# EAGLE schematic Schematic v17 (EAGLE 9.7.0)
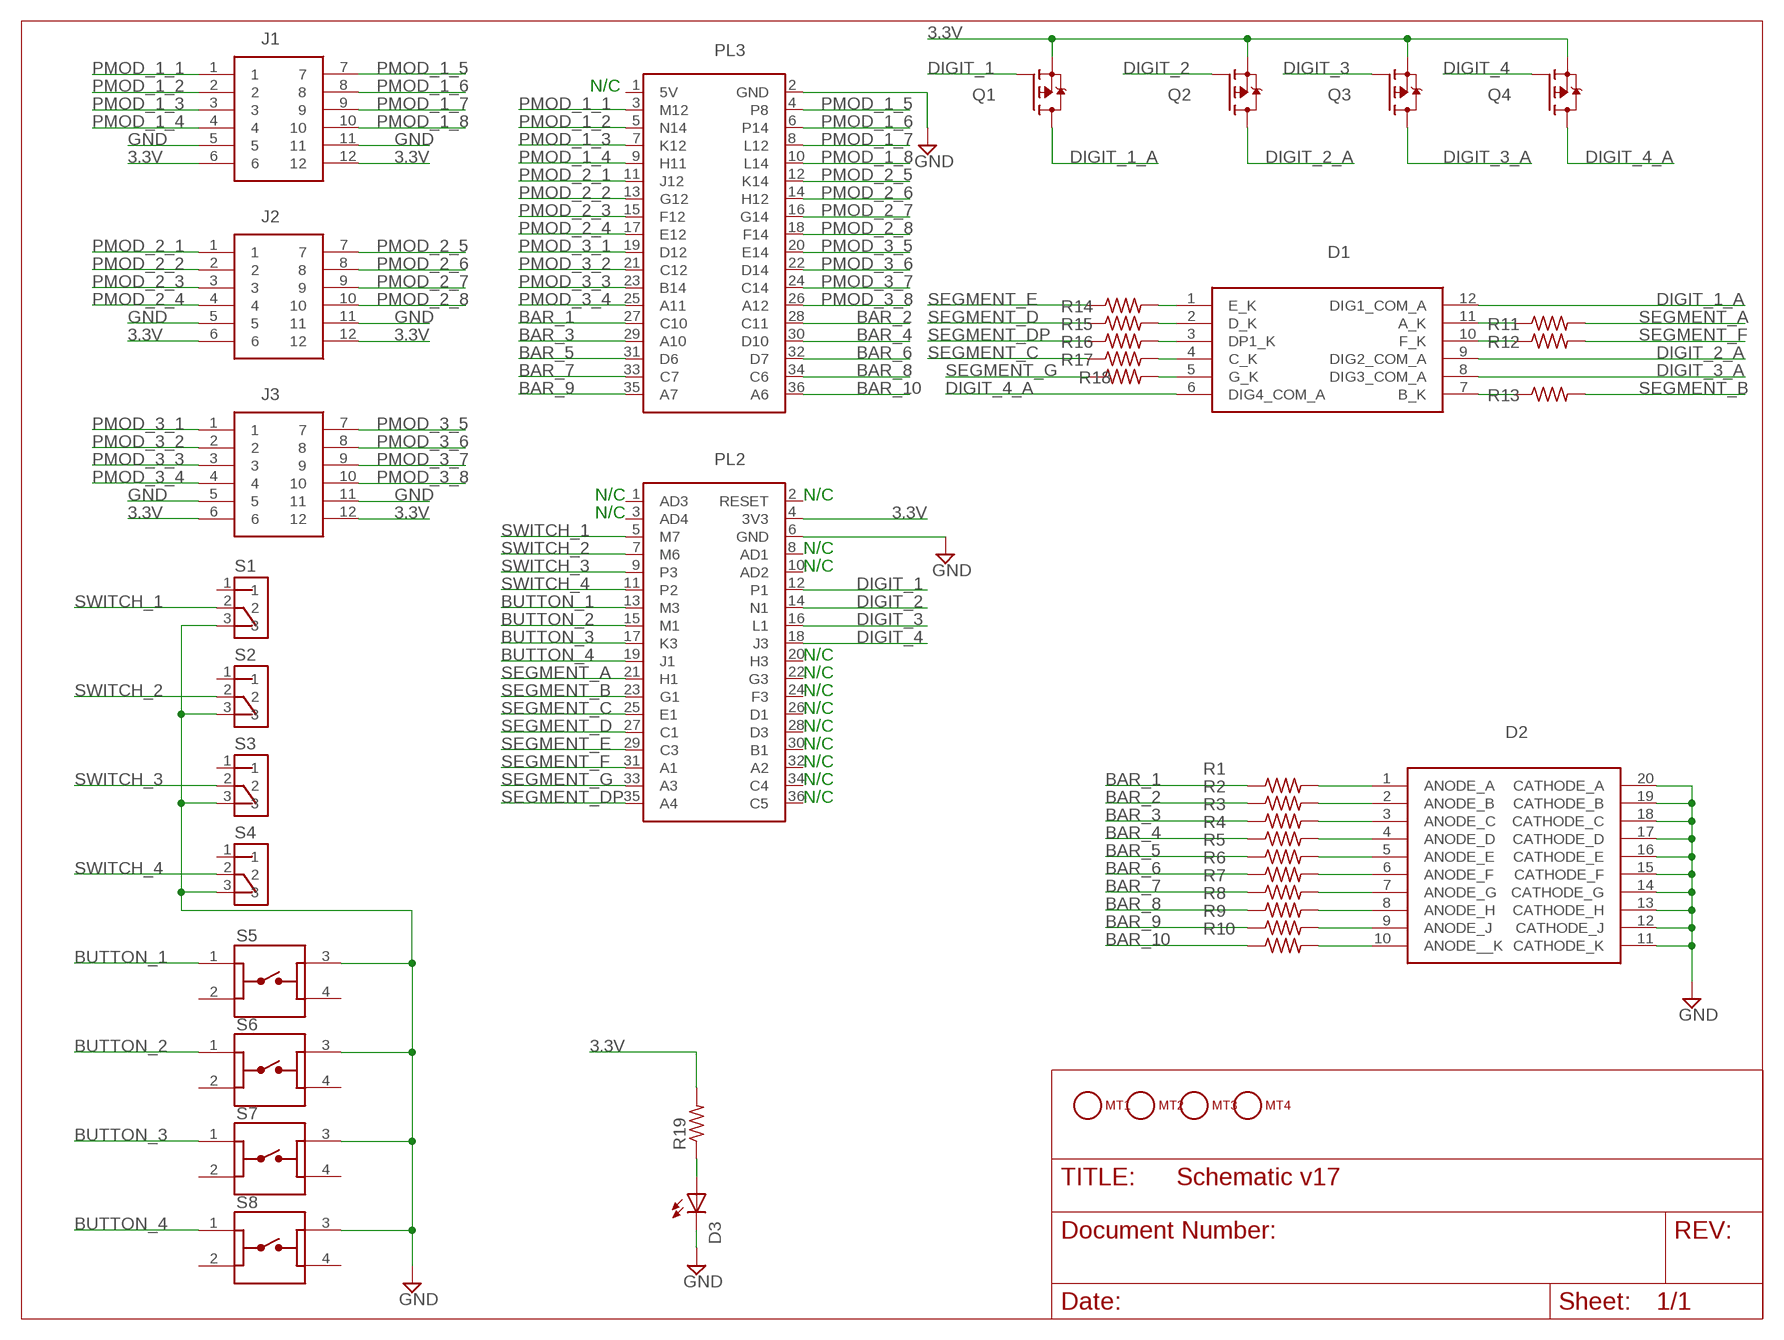
[diagram p0: schematic, sheet 1]

## Parts
D1  LDQ-M282RI  [LDQM282RI]
D2  LTA-1000G  [DIPS762W50P254L2527H825Q20N]
D3  LED5MM  [LED5MM]
J1  PMOD-SOCKET-FOR-HOST-BOARD  [PMOD-SOCKET-FOR-HOST-BOARD]
J2  PMOD-SOCKET-FOR-HOST-BOARD  [PMOD-SOCKET-FOR-HOST-BOARD]
J3  PMOD-SOCKET-FOR-HOST-BOARD  [PMOD-SOCKET-FOR-HOST-BOARD]
MT1  MOUNTING_HOLE-125_250_ROUND  [MT_125_250]
MT2  MOUNTING_HOLE-125_250_ROUND  [MT_125_250]
MT3  MOUNTING_HOLE-125_250_ROUND  [MT_125_250]
MT4  MOUNTING_HOLE-125_250_ROUND  [MT_125_250]
PL2  ICEWERX-PL2  [TE_4-1734506-1]
PL3  ICEWERX-PL3  [TE_4-1734506-1]
Q1  NX2301P  [SOT95P230X110-3N]
Q2  NX2301P  [SOT95P230X110-3N]
Q3  NX2301P  [SOT95P230X110-3N]
Q4  NX2301P  [SOT95P230X110-3N]
R1  R-US_0204/5  [0204/5]
R2  R-US_0204/5  [0204/5]
R3  R-US_0204/5  [0204/5]
R4  R-US_0204/5  [0204/5]
R5  R-US_0204/5  [0204/5]
R6  R-US_0204/5  [0204/5]
R7  R-US_0204/5  [0204/5]
R8  R-US_0204/5  [0204/5]
R9  R-US_0204/5  [0204/5]
R10  R-US_0204/5  [0204/5]
R11  R-US_0204/5  [0204/5]
R12  R-US_0204/5  [0204/5]
R13  R-US_0204/5  [0204/5]
R14  R-US_0204/5  [0204/5]
R15  R-US_0204/5  [0204/5]
R16  R-US_0204/5  [0204/5]
R17  R-US_0204/5  [0204/5]
R18  R-US_0204/5  [0204/5]
R19  R-US_0204/5  [0204/5]
S1  OS102011MS2QN1  [SW_OS102011MS2QN1]
S2  OS102011MS2QN1  [SW_OS102011MS2QN1]
S3  OS102011MS2QN1  [SW_OS102011MS2QN1]
S4  OS102011MS2QN1  [SW_OS102011MS2QN1]
S5  1825910-7  [SW_1825910-7]
S6  1825910-7  [SW_1825910-7]
S7  1825910-7  [SW_1825910-7]
S8  1825910-7  [SW_1825910-7]

## Nets
3.3V: J1.6 J1.12 J2.6 J2.12 J3.6 J3.12 PL2.4(3V3) Q1.2(S) Q2.2(S) Q3.2(S) Q4.2(S) R19.2
BAR_1: PL3.27(C10) R1.1
BAR_2: PL3.28(C11) R2.1
BAR_3: PL3.29(A10) R3.1
BAR_4: PL3.30(D10) R4.1
BAR_5: PL3.31(D6) R5.1
BAR_6: PL3.32(D7) R6.1
BAR_7: PL3.33(C7) R7.1
BAR_8: PL3.34(C6) R8.1
BAR_9: PL3.35(A7) R9.1
BAR_10: PL3.36(A6) R10.1
BUTTON_1: PL2.13(M3) S5.1
BUTTON_2: PL2.15(M1) S6.1
BUTTON_3: PL2.17(K3) S7.1
BUTTON_4: PL2.19(J1) S8.1
DIGIT_1: PL2.12(P1) Q1.1(G)
DIGIT_1_A: D1.12(DIG1_COM_A) Q1.3(D)
DIGIT_2: PL2.14(N1) Q2.1(G)
DIGIT_2_A: D1.9(DIG2_COM_A) Q2.3(D)
DIGIT_3: PL2.16(L1) Q3.1(G)
DIGIT_3_A: D1.8(DIG3_COM_A) Q3.3(D)
DIGIT_4: PL2.18(J3) Q4.1(G)
DIGIT_4_A: D1.6(DIG4_COM_A) Q4.3(D)
GND: D2.11(CATHODE_K) D2.12(CATHODE_J) D2.13(CATHODE_H) D2.14(CATHODE_G) D2.15(CATHODE_F) D2.16(CATHODE_E) D2.17(CATHODE_D) D2.18(CATHODE_C) D2.19(CATHODE_B) D2.20(CATHODE_A) D3.K(C) J1.5 J1.11 J2.5 J2.11 J3.5 J3.11 PL2.6(GND) PL3.2(GND) S1.3 S2.3 S3.3 S4.3 S5.3 S6.3 S7.3 S8.3
N$1: D2.1(ANODE_A) R1.2
N$2: D2.2(ANODE_B) R2.2
N$3: D2.3(ANODE_C) R3.2
N$4: D2.4(ANODE_D) R4.2
N$5: D2.5(ANODE_E) R5.2
N$6: D2.6(ANODE_F) R6.2
N$7: D2.7(ANODE_G) R7.2
N$8: D2.8(ANODE_H) R8.2
N$9: D2.9(ANODE_J) R9.2
N$10: D2.10(ANODE__K) R10.2
N$11: D1.11(A_K) R11.1
N$12: D1.10(F_K) R12.1
N$13: D1.2(D_K) R15.2
N$14: D1.7(B_K) R13.1
N$15: D1.3(DP1_K) R16.2
N$16: D1.1(E_K) R14.2
N$17: D1.4(C_K) R17.2
N$18: D1.5(G_K) R18.2
N$20: D3.A R19.1
PMOD_1_1: J1.1 PL3.3(M12)
PMOD_1_2: J1.2 PL3.5(N14)
PMOD_1_3: J1.3 PL3.7(K12)
PMOD_1_4: J1.4 PL3.9(H11)
PMOD_1_5: J1.7 PL3.4(P8)
PMOD_1_6: J1.8 PL3.6(P14)
PMOD_1_7: J1.9 PL3.8(L12)
PMOD_1_8: J1.10 PL3.10(L14)
PMOD_2_1: J2.1 PL3.11(J12)
PMOD_2_2: J2.2 PL3.13(G12)
PMOD_2_3: J2.3 PL3.15(F12)
PMOD_2_4: J2.4 PL3.17(E12)
PMOD_2_5: J2.7 PL3.12(K14)
PMOD_2_6: J2.8 PL3.14(H12)
PMOD_2_7: J2.9 PL3.16(G14)
PMOD_2_8: J2.10 PL3.18(F14)
PMOD_3_1: J3.1 PL3.19(D12)
PMOD_3_2: J3.2 PL3.21(C12)
PMOD_3_3: J3.3 PL3.23(B14)
PMOD_3_4: J3.4 PL3.25(A11)
PMOD_3_5: J3.7 PL3.20(E14)
PMOD_3_6: J3.8 PL3.22(D14)
PMOD_3_7: J3.9 PL3.24(C14)
PMOD_3_8: J3.10 PL3.26(A12)
SEGMENT_A: PL2.21(H1) R11.2
SEGMENT_B: PL2.23(G1) R13.2
SEGMENT_C: PL2.25(E1) R17.1
SEGMENT_D: PL2.27(C1) R15.1
SEGMENT_DP: PL2.35(A4) R16.1
SEGMENT_E: PL2.29(C3) R14.1
SEGMENT_F: PL2.31(A1) R12.2
SEGMENT_G: PL2.33(A3) R18.1
SWITCH_1: PL2.5(M7) S1.2
SWITCH_2: PL2.7(M6) S2.2
SWITCH_3: PL2.9(P3) S3.2
SWITCH_4: PL2.11(P2) S4.2
Unconnected: MT1.1 MT2.1 MT3.1 MT4.1 PL2.1(AD3) PL2.2(RESET) PL2.3(AD4) PL2.8(AD1) PL2.10(AD2) PL2.20(H3) PL2.22(G3) PL2.24(F3) PL2.26(D1) PL2.28(D3) PL2.30(B1) PL2.32(A2) PL2.34(C4) PL2.36(C5) PL3.1(5V) S1.1 S2.1 S3.1 S4.1 S5.2 S5.4 S6.2 S6.4 S7.2 S7.4 S8.2 S8.4

## Notes on the sheet
- N/C
- N/C | N/C
- N/C
- N/C
- N/C
- N/C
- N/C
- N/C
- N/C
- N/C
- N/C
- N/C
- N/C
- N/C

## Library data of the parts
D1 = eagle-library-engr-240-f24:LDQ-M282RI: LED Displays & Accessories LED Display Source: Datasheet <https://componentsearchengine.com/Datasheets/1/LDQ-M282RI.pdf>; DESCRIPTION: LED Displays & Accessories LED Display; HEIGHT: 6.05mm; MANUFACTURER_NAME: Lumex; MANUFACTURER_PART_NUMBER: LDQ-M282RI; MOUSER_PART_NUMBER: 696-LDQ-M282RI; MOUSER_PRICE-STOCK: https://www.mouser.com/Search/Refine.aspx?Keyword=696-LDQ-M282RI
D2 = eagle-library-engr-240-f24:LTA-1000G: LED Uni-Color Green 565nm 20-Pin PDIP Source: Datasheet <https://optoelectronics.liteon.com/upload/download/DS-30-92-0809/A1000G.pdf>; DESCRIPTION: LED Uni-Color Green 565nm 20-Pin PDIP; HEIGHT: 8.25mm; MANUFACTURER_NAME: Lite-On; MANUFACTURER_PART_NUMBER: LTA-1000G; MOUSER_PART_NUMBER: 859-LTA-1000G; MOUSER_PRICE-STOCK: https://www.mouser.co.uk/ProductDetail/Lite-On/LTA-1000G?qs=%2FTKcI5XXRKq0QINzVmwJHg%3D%3D
D3 = eagle-library-engr-240-f24:LED: LED OSRAM: - CHIPLED LG R971, LG N971, LY N971, LG Q971, LY Q971, LO R971, LY R971 LH N974, LH R974 LS Q976, LO Q976, LY Q976 LO Q996 - Hyper CHIPLED LW Q18S LB Q993, LB Q99A, LB R99A - SideLED LS A670, LO A670, LY A670, LG A670, LP A670 LB A673, LV A673, LT A673, LW A673 LH A674 LY A675 LS A676, LA A676, LO A676, LY A676, LW A676 LS A679, LY A679, LG A679 - Hyper Micro SIDELED® LS Y876, LA Y876, LO Y876, LY Y876 LT Y87S - SmartLED LW L88C, LW L88S LB L89C, LB L89S, LG L890 LS L89K, LO L89K, LY L89K LS L896, LA L896, LO L896, LY L896 - TOPLED LS T670, LO T670, LY T670, LG T670, LP T670 LSG T670, LSP T670, LSY T670, LOP T670, LYG T670 LG T671, LOG T671, LSG T671 LB T673, LV T673, LT T673, LW T673 LH T674 LS T676, LA T676, LO T676, LY T676, LB T676, LH T676, LSB T676, LW T676 LB T67C, LV T67C, LT T67C, LS T67K, LO T67K, LY T67K, LW E67C LS E67B, LA E67B, LO E67B, LY E67B, LB E67C, LV E67C, LT E67C LW T67C LS T679, LY T679, LG T679 LS T770, LO T770, LY T770, LG T770, LP T770 LB T773, LV T773, LT T773, LW T773 LH T774 LS E675, LA E675, LY E675, LS T675 LS T776, LA T776, LO T776, LY T776, LB T776 LHGB T686 LT T68C, LB T68C - Hyper Mini TOPLED® LB M676 - Mini TOPLED Santana® LG M470 LS M47K, LO M47K, LY M47K Source: http://www.osram.convergy.de/
J1-J3 = eagle-library-engr-240-f24:PMOD-SOCKET-FOR-HOST-BOARD
MT1-MT4 = eagle-library-engr-240-f24:MOUNTING_HOLE
PL2 = eagle-library-engr-240-f24:ICEWERX-PL2
PL3 = eagle-library-engr-240-f24:ICEWERX-PL3
Q1-Q4 = eagle-library-engr-240-f24:NX2301P; MANUFACTURER: Nexperia; MAXIMUM_PACKAGE_HEIGHT: 1.10 mm; PARTREV: 1; SNAPEDA_PN: NX2301P; STANDARD: IPC 7351B
R1-R19 = eagle-library-engr-240-f24:R-US_: RESISTOR, American symbol
S1-S4 = eagle-library-engr-240-f24:OS102011MS2QN1: Switch Slide ON ON SPDT Top Slide 0.1A 12VDC 10000Cycles PC Pins Thru-Hole Bulk; MANUFACTURER: C&K; STANDARD: MANUFACTURER RECOMMENDATIONS
S5-S8 = eagle-library-engr-240-f24:1825910-7: Switch Tactile OFF (ON) SPST Round Button PC Pins 0.05A 24VDC 100000Cycles 2.55N Thru-Hole Loose; MANUFACTURER: TE Connectivity; PARTREV: C10; STANDARD: Manufacturer Recommendation